# Altium schematic sheet dram1.SCHDOC: First DDR SDRAM
size A3; Organization: Berne University of Applied Science; Address1: School of Engineering and; Address2: Information Technology; Address3: Quellgasse 21; Address4: CH-2501 Biel; Revision: 1.0; SheetNumber: 9; SheetTotal: 19; ApprovedBy: zem1; Author: zac1
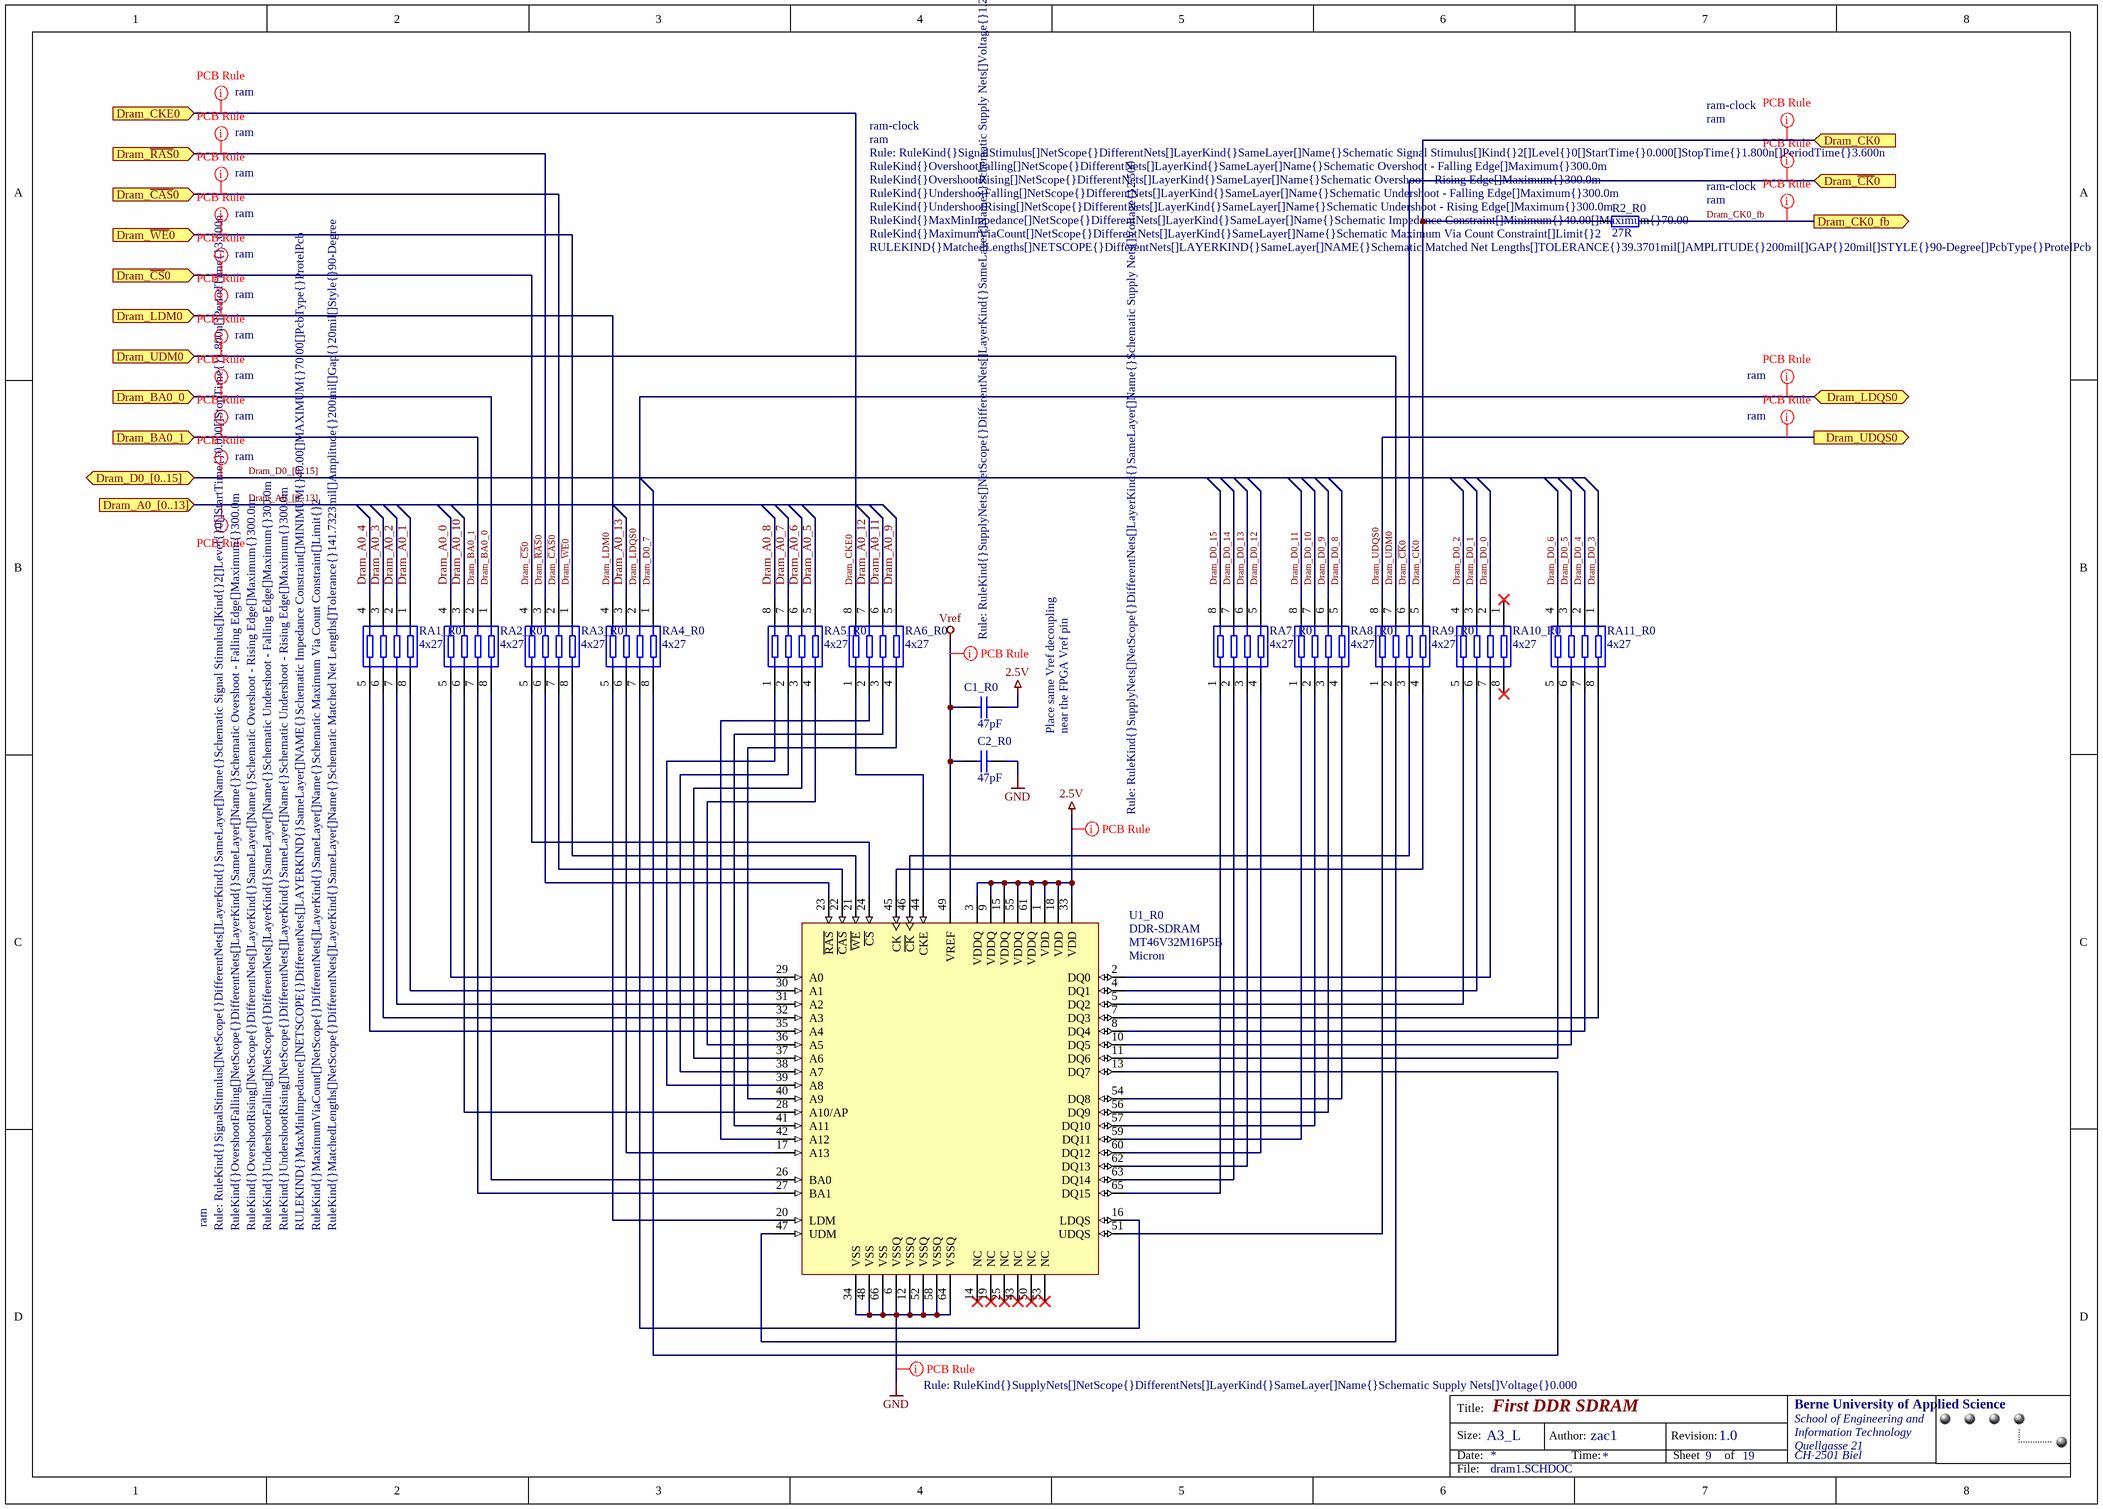
[diagram p0: dram1.SCHDOC]

## Parts
C1_R0  value 47pF  [0402]  (hidden comment: Cap)
C2_R0  value 47pF  [0402]  (hidden comment: Cap)
R2_R0  value 27R  [0402]  (hidden comment: Res2)
RA1_R0  value 4x27  [1206_ARRAY]
RA2_R0  value 4x27  [1206_ARRAY]
RA3_R0  value 4x27  [1206_ARRAY]
RA4_R0  value 4x27  [1206_ARRAY]
RA5_R0  value 4x27  [1206_ARRAY]
RA6_R0  value 4x27  [1206_ARRAY]
RA7_R0  value 4x27  [1206_ARRAY]
RA8_R0  value 4x27  [1206_ARRAY]
RA9_R0  value 4x27  [1206_ARRAY]
RA10_R0  value 4x27  [1206_ARRAY]
RA11_R0  value 4x27  [1206_ARRAY]
U1_R0  DDR-SDRAM  value MT46V32M16P5B  vendor: Micron  [TSOP66]

## Ports
Dram_A0_[0..13] (in), Dram_BA0_0 (in), Dram_BA0_1 (in), Dram_CK0 (in), Dram_CK0_fb (out), Dram_CKE0 (in), Dram_D0_[0..15] (bidir), Dram_LDM0 (in), Dram_LDQS0 (bidir), Dram_UDM0 (in), Dram_UDQS0 (out), Dram_~{CAS}0 (in), Dram_~{CK}0 (in), Dram_~{CS}0 (in), Dram_~{RAS}0 (in), Dram_~{WE}0 (in)

## Nets
2.5V: C1_R0.1 U1_R0.1(VDD) U1_R0.3(VDDQ) U1_R0.9(VDDQ) U1_R0.15(VDDQ) U1_R0.18(VDD) U1_R0.33(VDD) U1_R0.55(VDDQ) U1_R0.61(VDDQ)
GND: C2_R0.1 U1_R0.6(VSSQ) U1_R0.12(VSSQ) U1_R0.34(VSS) U1_R0.48(VSS) U1_R0.52(VSSQ) U1_R0.58(VSSQ) U1_R0.64(VSSQ) U1_R0.66(VSS)
Vref: C1_R0.2 C2_R0.2 U1_R0.49(VREF)
Dram_A0_0: RA2_R0.4
Dram_A0_1: RA1_R0.1
Dram_A0_2: RA1_R0.2
Dram_A0_3: RA1_R0.3
Dram_A0_4: RA1_R0.4
Dram_A0_5: RA5_R0.5
Dram_A0_6: RA5_R0.6
Dram_A0_7: RA5_R0.7
Dram_A0_8: RA5_R0.8
Dram_A0_9: RA6_R0.5
Dram_A0_10: RA2_R0.3
Dram_A0_11: RA6_R0.6
Dram_A0_12: RA6_R0.7
Dram_A0_13: RA4_R0.3
Dram_BA0_0: RA2_R0.1 ; port Dram_BA0_0
Dram_BA0_1: RA2_R0.2 ; port Dram_BA0_1
Dram_~{CAS}0: RA3_R0.2 ; port Dram_~{CAS}0
Dram_~{CK}0: RA9_R0.6 ; port Dram_~{CK}0
Dram_~{CS}0: RA3_R0.4 ; port Dram_~{CS}0
Dram_CK0: R2_R0.2 RA9_R0.5 ; port Dram_CK0
Dram_CK0_fb: R2_R0.1 ; port Dram_CK0_fb
Dram_CKE0: RA6_R0.8 ; port Dram_CKE0
Dram_D0_0: RA10_R0.2
Dram_D0_1: RA10_R0.3
Dram_D0_2: RA10_R0.4
Dram_D0_3: RA11_R0.1
Dram_D0_4: RA11_R0.2
Dram_D0_5: RA11_R0.3
Dram_D0_6: RA11_R0.4
Dram_D0_7: RA4_R0.1
Dram_D0_8: RA8_R0.5
Dram_D0_9: RA8_R0.6
Dram_D0_10: RA8_R0.7
Dram_D0_11: RA8_R0.8
Dram_D0_12: RA7_R0.5
Dram_D0_13: RA7_R0.6
Dram_D0_14: RA7_R0.7
Dram_D0_15: RA7_R0.8
Dram_LDM0: RA4_R0.4 ; port Dram_LDM0
Dram_LDQS0: RA4_R0.2 ; port Dram_LDQS0
Dram_~{RAS}0: RA3_R0.3 ; port Dram_~{RAS}0
Dram_UDM0: RA9_R0.7 ; port Dram_UDM0
Dram_UDQS0: RA9_R0.8 ; port Dram_UDQS0
Dram_~{WE}0: RA3_R0.1 ; port Dram_~{WE}0
NetRA1_R0_5: RA1_R0.5 U1_R0.35(A4)
NetRA1_R0_6: RA1_R0.6 U1_R0.32(A3)
NetRA1_R0_7: RA1_R0.7 U1_R0.31(A2)
NetRA1_R0_8: RA1_R0.8 U1_R0.30(A1)
NetRA2_R0_5: RA2_R0.5 U1_R0.29(A0)
NetRA2_R0_6: RA2_R0.6 U1_R0.28(A10/AP)
NetRA2_R0_7: RA2_R0.7 U1_R0.27(BA1)
NetRA2_R0_8: RA2_R0.8 U1_R0.26(BA0)
NetRA3_R0_5: RA3_R0.5 U1_R0.24(~{CS})
NetRA3_R0_6: RA3_R0.6 U1_R0.23(~{RAS})
NetRA3_R0_7: RA3_R0.7 U1_R0.22(~{CAS})
NetRA3_R0_8: RA3_R0.8 U1_R0.21(~{WE})
NetRA4_R0_5: RA4_R0.5 U1_R0.20(LDM)
NetRA4_R0_6: RA4_R0.6 U1_R0.17(A13)
NetRA4_R0_7: RA4_R0.7 U1_R0.16(LDQS)
NetRA4_R0_8: RA4_R0.8 U1_R0.13(DQ7)
NetRA5_R0_1: RA5_R0.1 U1_R0.39(A8)
NetRA5_R0_2: RA5_R0.2 U1_R0.38(A7)
NetRA5_R0_3: RA5_R0.3 U1_R0.37(A6)
NetRA5_R0_4: RA5_R0.4 U1_R0.36(A5)
NetRA6_R0_1: RA6_R0.1 U1_R0.44(CKE)
NetRA6_R0_2: RA6_R0.2 U1_R0.42(A12)
NetRA6_R0_3: RA6_R0.3 U1_R0.41(A11)
NetRA6_R0_4: RA6_R0.4 U1_R0.40(A9)
NetRA7_R0_1: RA7_R0.1 U1_R0.65(DQ15)
NetRA7_R0_2: RA7_R0.2 U1_R0.63(DQ14)
NetRA7_R0_3: RA7_R0.3 U1_R0.62(DQ13)
NetRA7_R0_4: RA7_R0.4 U1_R0.60(DQ12)
NetRA8_R0_1: RA8_R0.1 U1_R0.59(DQ11)
NetRA8_R0_2: RA8_R0.2 U1_R0.57(DQ10)
NetRA8_R0_3: RA8_R0.3 U1_R0.56(DQ9)
NetRA8_R0_4: RA8_R0.4 U1_R0.54(DQ8)
NetRA9_R0_1: RA9_R0.1 U1_R0.51(UDQS)
NetRA9_R0_2: RA9_R0.2 U1_R0.47(UDM)
NetRA9_R0_3: RA9_R0.3 U1_R0.46(~{CK})
NetRA9_R0_4: RA9_R0.4 U1_R0.45(CK)
NetRA10_R0_5: RA10_R0.5 U1_R0.5(DQ2)
NetRA10_R0_6: RA10_R0.6 U1_R0.4(DQ1)
NetRA10_R0_7: RA10_R0.7 U1_R0.2(DQ0)
NetRA11_R0_5: RA11_R0.5 U1_R0.11(DQ6)
NetRA11_R0_6: RA11_R0.6 U1_R0.10(DQ5)
NetRA11_R0_7: RA11_R0.7 U1_R0.8(DQ4)
NetRA11_R0_8: RA11_R0.8 U1_R0.7(DQ3)

Not connected (* = marked no-connect by the designer): RA10_R0 1* 8*; U1_R0 14(NC)* 19(NC)* 25(NC)* 43(NC)* 50(NC)* 53(NC)*

## Buses and harness runs
bus Dram_A0_[0..13] = port Dram_A0_[0..13]
bus Dram_D0_[0..15] = port Dram_D0_[0..15]

## Layout directives
rule Supply Nets [Voltage =  2.500]: 2.5V
rule Supply Nets [Voltage =  1.250]: Vref
rule Supply Nets [Voltage =  0.000]: GND
rule Signal Stimulus [Kind - Periodic Pulse    Level - Low    Start Time =  0.000    Stop Time =  1.800n    Period Time =  3.600n]; rule Overshoot - Falling Edge [Max =  300.0m]; rule Overshoot - Rising Edge [Max =  300.0m]; rule Undershoot - Falling Edge [Max =  300.0m]; rule Undershoot - Rising Edge [Max =  300.0m]; rule Impedance Constraint [Min = 40.00    Max = 70.00    ]; rule Maximum Via Count Constraint [Max Count = 2]; rule Matched Net Lengths [Tolerance = 3.6mm    Style - 90 Degrees    Amplitude = 5.08mm    Gap = 0.508mm    ]; net class ram: (no net found under the mark)
rule Signal Stimulus [Kind - Periodic Pulse    Level - Low    Start Time =  0.000    Stop Time =  1.800n    Period Time =  3.600n]; rule Overshoot - Falling Edge [Max =  300.0m]; rule Overshoot - Rising Edge [Max =  300.0m]; rule Undershoot - Falling Edge [Max =  300.0m]; rule Undershoot - Rising Edge [Max =  300.0m]; rule Impedance Constraint [Min =  40.00    Max =  70.00    ]; rule Maximum Via Count Constraint [Max Count = 2]; rule Matched Net Lengths [Tolerance = 1mm    Style - 90 Degrees    Amplitude = 5.08mm    Gap = 0.508mm    ]; net class ram-clock; net class ram: Dram_~{CK}0
net class ram-clock; net class ram: Dram_CK0, Dram_CK0_fb
net class ram: (no net found under the mark), Dram_BA0_0, Dram_BA0_1, Dram_CKE0, Dram_LDM0, Dram_LDQS0, Dram_UDM0, Dram_UDQS0, Dram_~{CAS}0, Dram_~{CS}0, Dram_~{RAS}0, Dram_~{WE}0

## Notes on the sheet
- Place same Vref decoupling
- near the FPGA Vref pin
- Title:
- Size:
- Date:
- A3_L
- Author:
- Time:
- Revision:
- Sheet
- of
- File:

## Library data of the parts
C1_R0 C2_R0 = Cap: Capacitor; Manufacturer: Murata; Part Number: GRM1555C1H470JZ01D; Class I: Passive; Currency: CHF; Packaging unit: 10; Prize: 0.07; Published: 8-Jun-2000; Revision: July-2002: Re-released for DXP Platform.; Publisher: Altium Limited; Class II: Capacitor; Distributor Number: 8819 670; RoHS: yes; Distributor: Farnell
R2_R0 = Res2: Resistor; Manufacturer: PHYCOMP; Part Number: 232270672709; Class I: Passive; Currency: CHF; Packaging unit: 50; Prize: 0.12; Published: 8-Jun-2000; Revision: July-2002: Re-released for DXP Platform.; Publisher: Altium Limited; Class II: Resistor; Distributor Number: 9239049; RoHS: yes; Distributor: Farnell
RA1_R0 RA2_R0 RA3_R0 RA4_R0 RA5_R0 RA6_R0 RA7_R0 RA8_R0 RA9_R0 RA10_R0 RA11_R0 = R_ARRAY_4_SMD: Manufacturer: PHYCOMP; Part Number: 235003410279; Currency: CHF; Packaging unit: 10; Prize: 0.17; Distributor Number: 9234969; RoHS: yes; Distributor: Farnell
U1_R0 = DDR-SDRAM: general model for ddr sdram's; Currency: CHF; lead time: 12 Weeks; Packaging unit: 108; Prize: 15.87; Distributor Number: MT46V32M16P5B; Manufacturer: Micron; Part Number: MT46V32M16P5B; RoHS: yes; Distributor: Silica